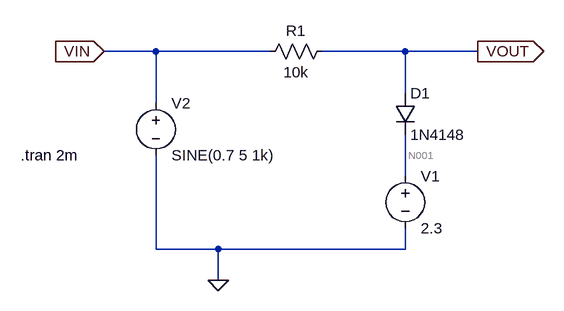
[diagram p0: schematic exp2_a.asc]
exp2_a.asc, the LTspice schematic file:
Version 4
SHEET 1 880 680
WIRE -64 80 -144 80
WIRE 112 80 -64 80
WIRE 320 80 192 80
WIRE 432 80 320 80
WIRE 320 144 320 80
WIRE -64 160 -64 80
WIRE 320 272 320 208
WIRE -64 384 -64 240
WIRE 32 384 -64 384
WIRE 320 384 320 352
WIRE 320 384 32 384
WIRE 32 432 32 384
FLAG 32 432 0
FLAG 432 80 VOUT
IOPIN 432 80 Out
FLAG -144 80 VIN
IOPIN -144 80 In
SYMBOL res 208 64 R90
WINDOW 0 0 56 VBottom 2
WINDOW 3 32 56 VTop 2
SYMATTR InstName R1
SYMATTR Value 10k
SYMBOL diode 304 144 R0
SYMATTR InstName D1
SYMATTR Value 1N4148
SYMBOL voltage 320 256 R0
WINDOW 123 0 0 Left 2
WINDOW 39 0 0 Left 2
SYMATTR InstName V1
SYMATTR Value 2.3
SYMBOL voltage -64 144 R0
WINDOW 123 0 0 Left 2
WINDOW 39 0 0 Left 2
SYMATTR InstName V2
SYMATTR Value SINE(0.7 5 1k)
TEXT -272 240 Left 2 !.tran 2m

The netlist it stands for:
* exp2_a.asc
R1 VOUT VIN 10k
D1 VOUT N001 1N4148
V1 N001 0 2.3
V2 VIN 0 SINE(0.7 5 1k)
.model D D
.lib standard.dio
.tran 2m
.backanno
.end

* Results of the author's LTspice run, read from the files saved beside the schematic
* Operating Point, zero values left out:
*   V(vout) = 700 mV
*   V(vin) = 700 mV
*   V(n001) = 2.3 V
*   I(D1) = -2.522 nA
*   I(R1) = 2.522 nA
*   I(V2) = 2.522 nA
*   I(V1) = -2.522 nA
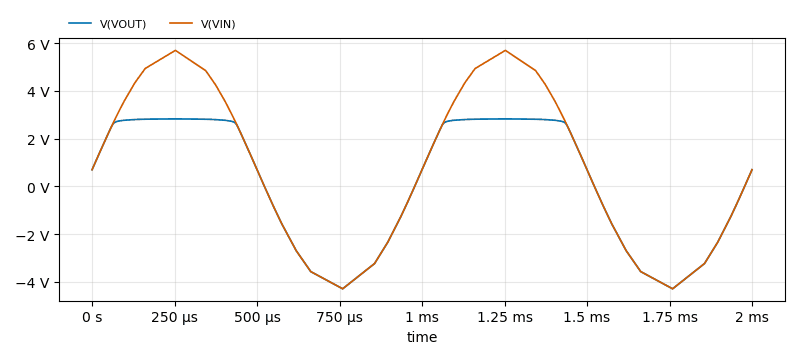
[diagram p1: Transient Analysis of exp2_a.asc, plotted from the saved traces]
* Transient Analysis, 1 run:
*   V(VOUT): min -4.287 V, max 2.828 V, average 46.27 mV, rms 2.722 V, last 699.2 mV
*   V(VIN): min -4.287 V, max 5.696 V, average 705.7 mV, rms 3.546 V, last 700 mV